# EAGLE design mk-logic (EAGLE 4.16)
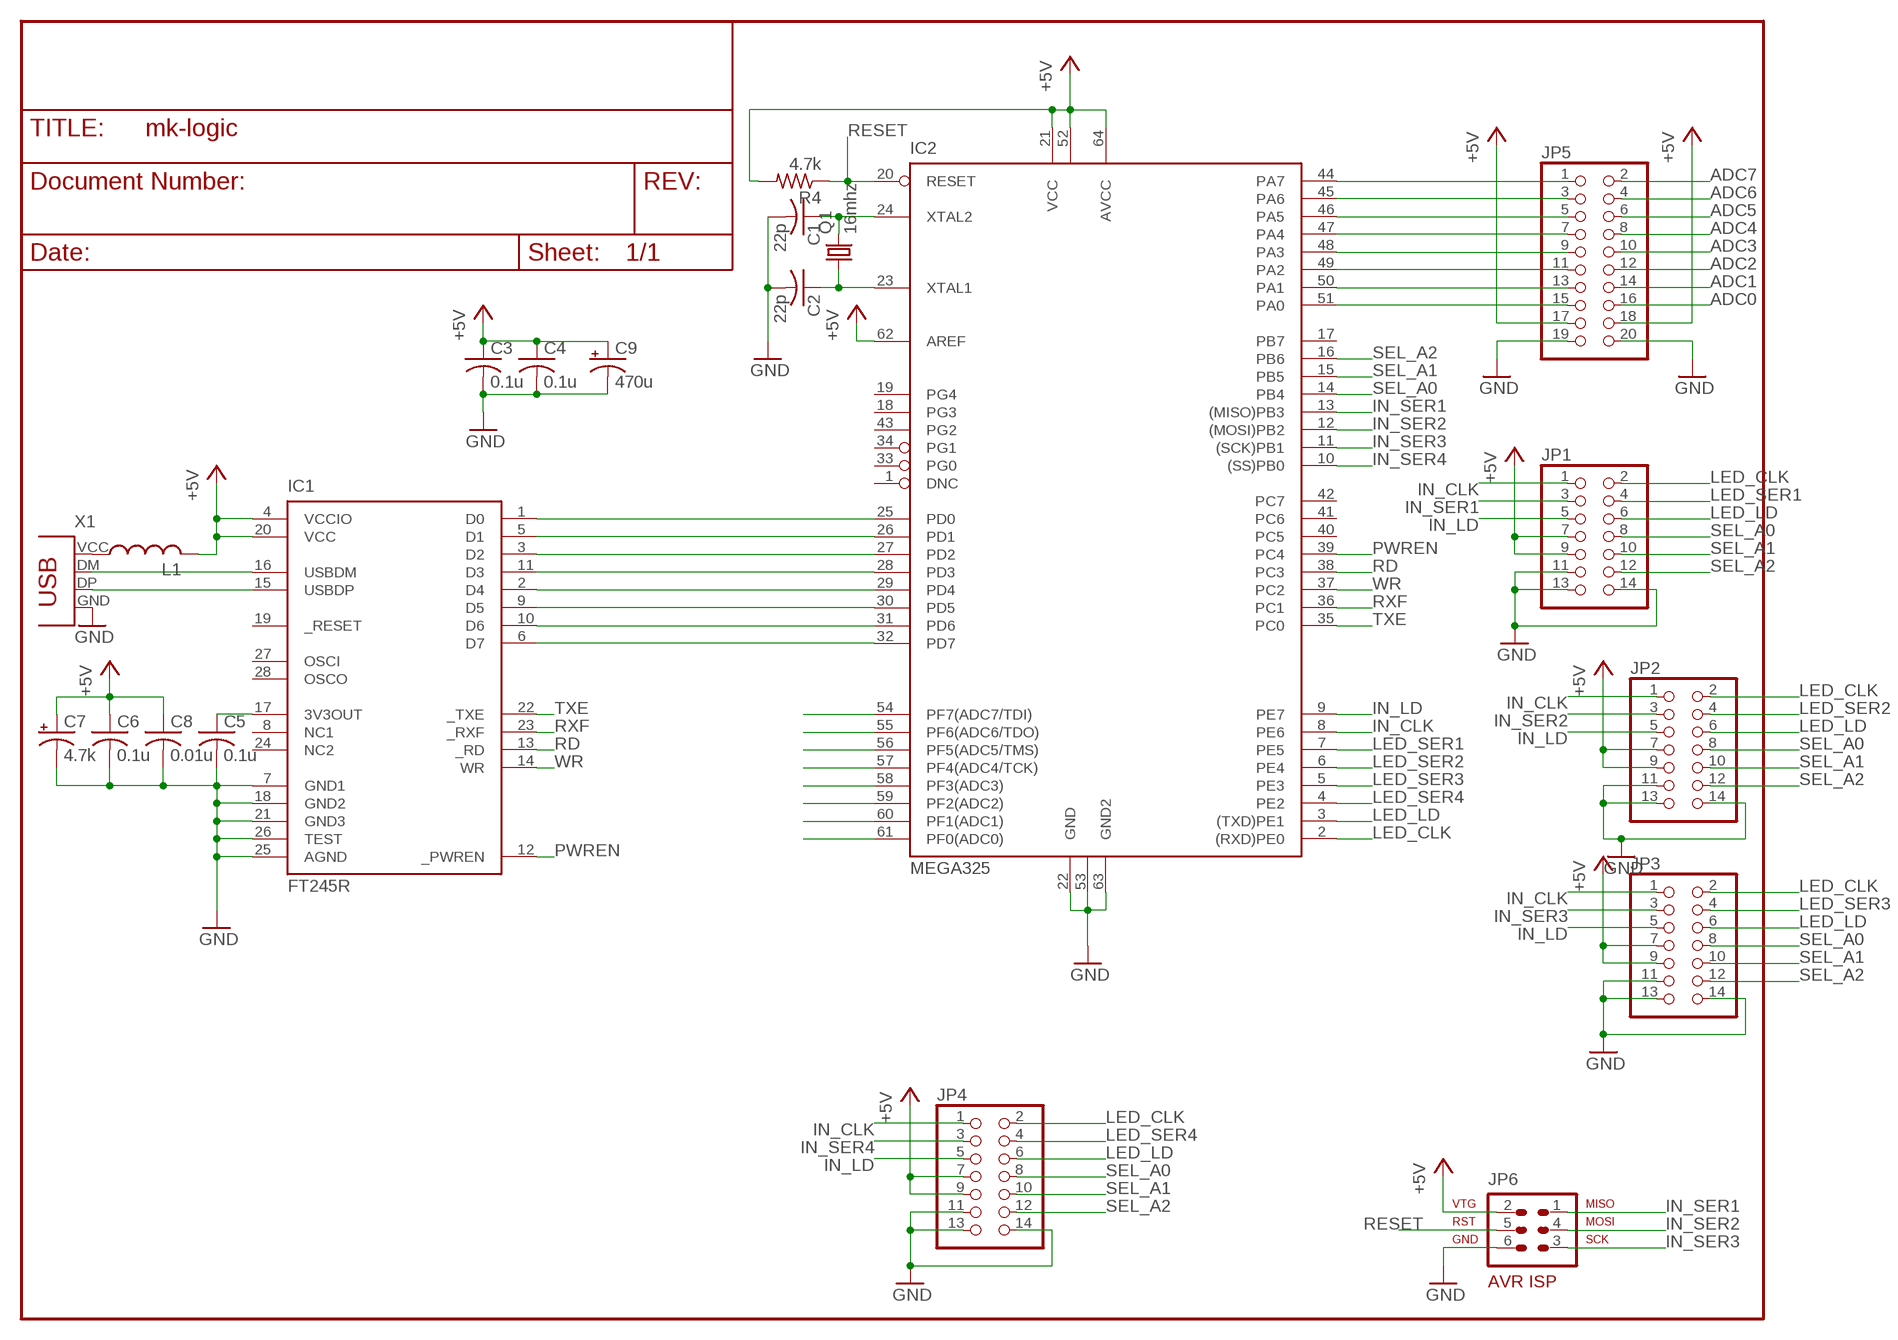
[diagram p0: schematic, sheet 1]

## Parts
C1  22p  C-USC1206  [C1206]
C2  22p  C-USC1206  [C1206]
C3  0.1u  C-USC1206  [C1206]
C4  0.1u  C-USC1206  [C1206]
C5  0.1u  C-USC1206  [C1206]
C6  0.1u  C-USC1206  [C1206]
C7  4.7k  CPOL-USB  [PANASONIC_B]
C8  0.01u  C-USC1206  [C1206]
C9  470u  CPOL-USE  [PANASONIC_E]
IC1  FT245R  [SSOP28]
IC2  MEGA325  [TQFP64]
JP1  PINHD-2X7  [2X07]
JP2  PINHD-2X7  [2X07]
JP3  PINHD-2X7  [2X07]
JP4  PINHD-2X7  [2X07]
JP5  PINHD-2X10  [2X10]
JP6  AVR-ISP  AVR-ISP-6  [AVR-ISP-6]
L1  L-USL3216C  [L3216C]
Q1  16mhz  CRYTALHC49UP  [HC49UP]
R4  4.7k  R-US_R1206  [R1206]
X1  USB_TYPE_B  [USB_B]

## Nets
+5V: C3.1 C4.1 C6.1 C7.+ C8.1 C9.+ IC1.4(VCCIO) IC1.20(VCC) IC2.21(VCC) IC2.52(VCC1) IC2.62(AREF) IC2.64(AVCC) JP1.7 JP1.9 JP2.7 JP2.9 JP3.7 JP3.9 JP4.7 JP4.9 JP5.17 JP5.18 JP6.2 L1.2 R4.2
ADC0: IC2.61(PF0(ADC0)) JP5.16
ADC1: IC2.60(PF1(ADC1)) JP5.14
ADC2: IC2.59(PF2(ADC2)) JP5.12
ADC3: IC2.58(PF3(ADC3)) JP5.10
ADC4: IC2.57(PF4(ADC4/TCK)) JP5.8
ADC5: IC2.56(PF5(ADC5/TMS)) JP5.6
ADC6: IC2.55(PF6(ADC6/TDO)) JP5.4
ADC7: IC2.54(PF7(ADC7/TDI)) JP5.2
GND: C1.2 C2.2 C3.2 C4.2 C5.2 C6.2 C7.- C8.2 C9.- IC1.7(GND1) IC1.18(GND2) IC1.21(GND3) IC1.25(AGND) IC1.26(TEST) IC2.22(GND) IC2.53(GND1) IC2.63(GND2) JP1.11 JP1.13 JP1.14 JP2.11 JP2.13 JP2.14 JP3.11 JP3.13 JP3.14 JP4.11 JP4.13 JP4.14 JP5.19 JP5.20 JP6.6 X1.GND
IN_CLK: IC2.8(PE6) JP1.1 JP2.1 JP3.1 JP4.1
IN_LD: IC2.9(PE7) JP1.5 JP2.5 JP3.5 JP4.5
IN_SER1: IC2.13((MISO)PB3) JP1.3 JP6.1
IN_SER2: IC2.12((MOSI)PB2) JP2.3 JP6.4
IN_SER3: IC2.11((SCK)PB1) JP3.3 JP6.3
IN_SER4: IC2.10((SS)PB0) JP4.3
LED_CLK: IC2.2((RXD)PE0) JP1.2 JP2.2 JP3.2 JP4.2
LED_LD: IC2.3((TXD)PE1) JP1.6 JP2.6 JP3.6 JP4.6
LED_SER1: IC2.7(PE5) JP1.4
LED_SER2: IC2.6(PE4) JP2.4
LED_SER3: IC2.5(PE3) JP3.4
LED_SER4: IC2.4(PE2) JP4.4
N$1: IC1.16(USBDM) X1.DM(USBDM)
N$2: IC1.15(USBDP) X1.DP(USBDP)
N$3: C5.1 IC1.17(3V3OUT)
N$4: IC2.44(PA7) JP5.1
N$5: IC2.45(PA6) JP5.3
N$6: IC2.46(PA5) JP5.5
N$7: IC2.47(PA4) JP5.7
N$8: C2.1 IC2.23(XTAL1) Q1.1
N$9: C1.1 IC2.24(XTAL2) Q1.2
N$10: IC2.48(PA3) JP5.9
N$11: IC2.49(PA2) JP5.11
N$12: L1.1 X1.VCC
N$13: IC1.1(D0) IC2.25(PD0)
N$14: IC1.5(D1) IC2.26(PD1)
N$15: IC1.3(D2) IC2.27(PD2)
N$16: IC1.11(D3) IC2.28(PD3)
N$17: IC1.2(D4) IC2.29(PD4)
N$18: IC1.9(D5) IC2.30(PD5)
N$19: IC1.10(D6) IC2.31(PD6)
N$20: IC1.6(D7) IC2.32(PD7)
N$23: IC2.50(PA1) JP5.13
N$24: IC2.51(PA0) JP5.15
PWREN: IC1.12(_PWREN) IC2.39(PC4)
RD: IC1.13(_RD) IC2.38(PC3)
RESET: IC2.20(RESET) JP6.5 R4.1
RXF: IC1.23(_RXF) IC2.36(PC1)
SEL_A0: IC2.14(PB4) JP1.8 JP2.8 JP3.8 JP4.8
SEL_A1: IC2.15(PB5) JP1.10 JP2.10 JP3.10 JP4.10
SEL_A2: IC2.16(PB6) JP1.12 JP2.12 JP3.12 JP4.12
TXE: IC1.22(_TXE) IC2.35(PC0)
WR: IC1.14(WR) IC2.37(PC2)
Unconnected: IC1.8(NC1) IC1.19(_RESET) IC1.24(NC2) IC1.27(OSCI) IC1.28(OSCO) IC2.1(DNC) IC2.17(PB7) IC2.18(PG3) IC2.19(PG4) IC2.33(PG0) IC2.34(PG1) IC2.40(PC5) IC2.41(PC6) IC2.42(PC7) IC2.43(PG2)

## Library data of the parts
C1-C6 C8 = rcl:C-US: CAPACITOR, American symbol
C7 C9 = rcl:CPOL-US: POLARIZED CAPACITOR, American symbol
IC1 = monome:FT245R: USB FIFO 2nd Generation USB FIFO (USB <-> Parallel)
IC2 = monome:MEGA325
JP1-JP4 = pinhead:PINHD-2X7: PIN HEADER
JP5 = pinhead:PINHD-2X10: PIN HEADER
JP6 = monome:AVR-ISP-6: AVR ISP-6 Serial Programming Header
L1 = rcl:L-US: INDUCTOR, American symbol
Q1 = crystal:CRYTAL: CRYSTAL
R4 = rcl:R-US_: RESISTOR, American symbol
X1 = monome:USB_TYPE_B: BERG USB connector

## Board
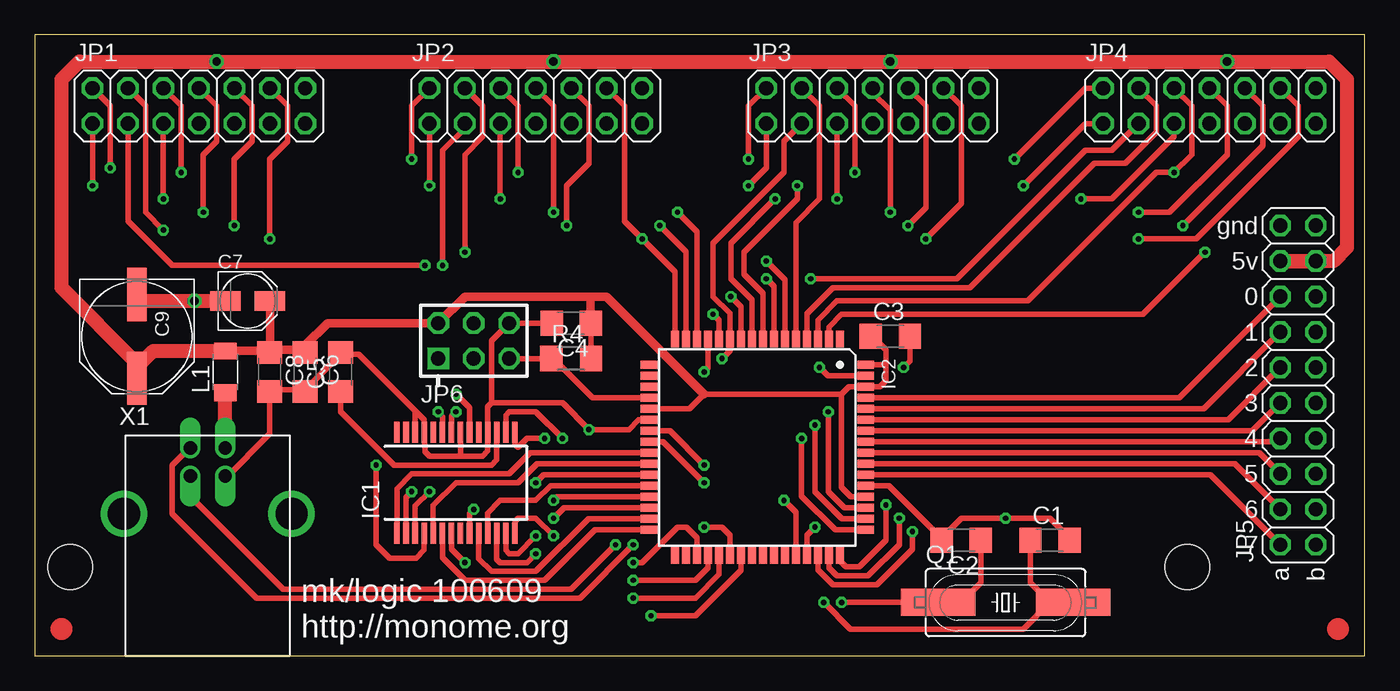
[diagram p1: board, top side]
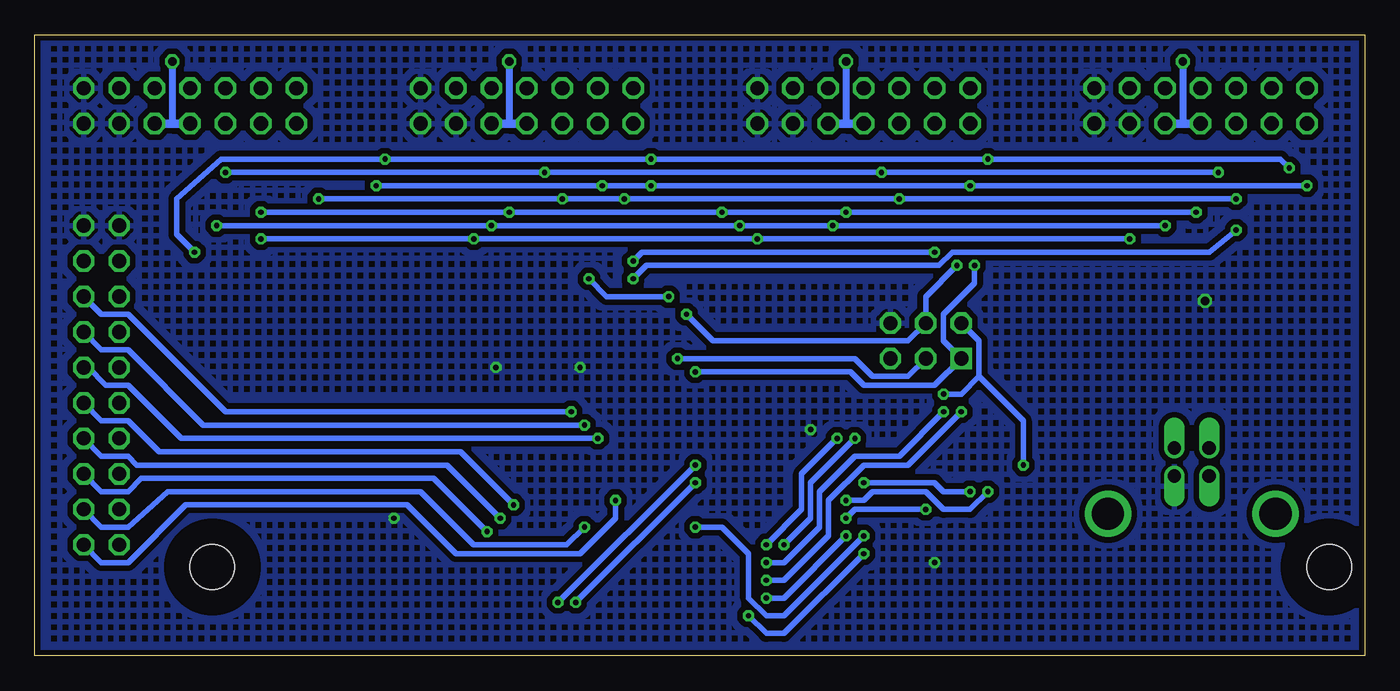
[diagram p2: board, bottom side, seen from below]

Size 95.25 x 44.45 mm. Coordinates in mm from the lower left corner, seen from the top.
Outline: 0,0 95.25,0 95.25,44.45 0,44.45 0,0
Copper layers (1+16): Top 0.035mm / dielectric 1.5mm / Bottom 0.035mm
Design rules "default": minimum track width 10mil, minimum drill 12mil, track to track 8mil, track to pad 8mil, pad to pad 8mil, via to via 8mil, smd to smd 8mil, copper to edge 10mil, drill to drill 8mil, minimum pad ring 10mil, minimum via ring 8mil, stop-mask expansion 4mil, vias tented up to drill 0mil, thermal gap 10mil
Holes 3.2 mm at 2.54,6.35 82.55,6.35
bRestrict: area 80,3.8 to 85.1,8.9; area 0,3.8 to 5.1,8.9

### Footprints (pad centres in the part's own frame; a part is rotated, then mirrored left to right if it is on the bottom)
C1206 = smd 1.6 x 1.8: 1 -1.4,0; 2 1.4,0
PANASONIC_B = smd 2.2 x 1.4: + 1.6,0; - -1.6,0
PANASONIC_E = smd 3.8 x 1.4: + 3,0; - -3,0
SSOP28 = smd 0.4 x 1.5: 1 -4.225,-3.625; 2 -3.575,-3.625; 3 -2.925,-3.625; 4 -2.275,-3.625; 5 -1.625,-3.625; 6 -0.975,-3.625; 7 -0.325,-3.625; 8 0.325,-3.625; 9 0.975,-3.625; 10 1.625,-3.625; 11 2.275,-3.625; 12 2.925,-3.625; 13 3.575,-3.625; 14 4.225,-3.625; 15 4.225,3.625; 16 3.575,3.625; 17 2.925,3.625; 18 2.275,3.625; 19 1.625,3.625; 20 0.975,3.625; 21 0.325,3.625; 22 -0.325,3.625; 23 -0.975,3.625; 24 -1.625,3.625; 25 -2.275,3.625; 26 -2.925,3.625; 27 -3.575,3.625; 28 -4.225,3.625
TQFP64 = smd 1.194 x 0.559: 1 -7.76,5.905; 2 -7.76,5.118; 3 -7.76,4.331; 4 -7.76,3.543; 5 -7.76,2.756; 6 -7.76,1.968; 7 -7.76,1.181; 8 -7.76,0.394; 9 -7.76,-0.394; 10 -7.76,-1.181; 11 -7.76,-1.968; 12 -7.76,-2.756; 13 -7.76,-3.543; 14 -7.76,-4.331; 15 -7.76,-5.118; 16 -7.76,-5.905; 33 7.76,-5.905; 34 7.76,-5.118; 35 7.76,-4.331; 36 7.76,-3.543; 37 7.76,-2.756; 38 7.76,-1.968; 39 7.76,-1.181; 40 7.76,-0.394; 41 7.76,0.394; 42 7.76,1.181; 43 7.76,1.968; 44 7.76,2.756; 45 7.76,3.543; 46 7.76,4.331; 47 7.76,5.118; 48 7.76,5.905 | smd 0.559 x 1.194: 17 -5.905,-7.76; 18 -5.118,-7.76; 19 -4.331,-7.76; 20 -3.543,-7.76; 21 -2.756,-7.76; 22 -1.968,-7.76; 23 -1.181,-7.76; 24 -0.394,-7.76; 25 0.394,-7.76; 26 1.181,-7.76; 27 1.968,-7.76; 28 2.756,-7.76; 29 3.543,-7.76; 30 4.331,-7.76; 31 5.118,-7.76; 32 5.905,-7.76; 49 5.905,7.76; 50 5.118,7.76; 51 4.331,7.76; 52 3.543,7.76; 53 2.756,7.76; 54 1.968,7.76; 55 1.181,7.76; 56 0.394,7.76; 57 -0.394,7.76; 58 -1.181,7.76; 59 -1.968,7.76; 60 -2.756,7.76; 61 -3.543,7.76; 62 -4.331,7.76; 63 -5.118,7.76; 64 -5.905,7.76
2X07 = drill 1.016 octagon: 1 -7.62,-1.27; 2 -7.62,1.27; 3 -5.08,-1.27; 4 -5.08,1.27; 5 -2.54,-1.27; 6 -2.54,1.27; 7 0,-1.27; 8 0,1.27; 9 2.54,-1.27; 10 2.54,1.27; 11 5.08,-1.27; 12 5.08,1.27; 13 7.62,-1.27; 14 7.62,1.27
2X10 = drill 1.016 octagon: 1 -11.43,-1.27; 2 -11.43,1.27; 3 -8.89,-1.27; 4 -8.89,1.27; 5 -6.35,-1.27; 6 -6.35,1.27; 7 -3.81,-1.27; 8 -3.81,1.27; 9 -1.27,-1.27; 10 -1.27,1.27; 11 1.27,-1.27; 12 1.27,1.27; 13 3.81,-1.27; 14 3.81,1.27; 15 6.35,-1.27; 16 6.35,1.27; 17 8.89,-1.27; 18 8.89,1.27; 19 11.43,-1.27; 20 11.43,1.27
AVR-ISP-6 = drill 1.016 square: 1 -2.54,-1.27 | drill 1.016 octagon: 2 -2.54,1.27; 3 0,-1.27; 4 0,1.27; 5 2.54,-1.27; 6 2.54,1.27
L3216C = smd 1.2 x 1.6: 1 -1.5,0; 2 1.5,0
HC49UP = smd 5.334 x 1.93: 1 -4.826,0; 2 4.826,0
R1206 = smd 1.6 x 1.803: 1 -1.422,0; 2 1.422,0
USB_B = drill 0.95 offset: DM -1.25,4.71; DP -1.25,2.71; GND 1.25,2.71; VCC 1.25,4.71 | drill 2.3 round: MOUNT1 -6,0; MOUNT2 6,0

### Placement (x,y rotation side)
C1  72.71,8.26 0 top
C2  66.36,8.26 180 top
C3  61.28,22.86 0 top
C4  38.42,23.81 180 top
C5  21.91,20.32 90 top
C6  19.37,20.32 270 top
C7  15.24,25.4 0 top
C8  16.83,20.32 270 top
C9  7.3,22.86 270 top
IC1  30.16,12.38 0 top
IC2  51.75,14.92 270 top
JP1  11.75,39.37 0 top
JP2  35.88,39.37 0 top
JP3  60.01,39.37 0 top
JP4  84.14,39.37 0 top
JP5  90.49,19.37 90 top
JP6  31.43,22.54 0 top
L1  13.65,20.32 90 top
Q1  69.53,3.81 0 top
R4  38.42,21.27 0 top
U$1  [FEDUCIAL]  93.34,1.91 0 top
U$2  [FEDUCIAL]  1.91,1.91 0 top
X1  12.38,10.16 0 top

### Tracks (layer width: path | path; a pad name or v marks a point on that pad's centre or on a via)
+5V  (via drill 0.38, 0.6)
  Top 0.406: IC2.64 60.96,20.83 60.96,20.64 | 60.96,20.64 60.96,19.68 60.53,19.25 IC2.62 58.31,19.25 57.78,18.73 | IC1.20 31.14,17.76 v30.16,18.73 | IC1.4 27.89,7.57 27.3,6.99 25.4,6.99 24.45,7.94 v24.45,13.65 | IC2.21 46.89,17.68 47.94,18.73 57.78,18.73 | IC2.52 58.47,11.38 57.78,12.06 57.78,18.73 | 40.01,25.72 39.82,25.72 | C4.1 39.69,23.81 39.84,23.66 R4.2 | C3.1 60.2,22.67 60.96,21.91 60.96,20.64
  Top 0.508: 7.3,20.64 7.3,20.95
  Top 0.61: 47.94,18.73 40.96,25.72 40.01,25.72 30.8,25.72 JP6.2 20.95,23.81 19.37,22.23 C6.1 19.37,21.59 19.05,21.91 16.83,21.91 | 39.82,25.72 C4.1 | L1.2 16.74,21.82 16.83,21.91 | 16.83,21.91 C8.1 | C7.+ 16.84,21.92 16.83,21.91
  Top 1.016: L1.2 8.48,21.82 7.3,20.64 C9.+ 7.3,19.68 | 7.3,20.95 1.91,26.35 1.91,41.27 3.17,42.55 v13.02,42.55 v37.15,42.55 v61.28,42.55 v85.41,42.55 92.71,42.55 93.98,41.27 93.98,29.21 93.03,28.26 JP5.18 JP5.17
  Bottom 0.406: 27.62,20 27.62,22.54 JP6.2 | 27.62,20 28.89,18.73 v30.16,18.73 | v24.45,13.65 24.45,16.83 27.62,20
  Bottom 0.508: v85.41,42.55 85.41,38.1 | v61.28,42.55 61.28,38.1 | v37.15,42.55 37.15,38.1 | v13.02,42.55 13.02,38.1
  Bottom 0.61: JP1.9 13.02,38.1 JP1.7 | JP2.9 37.15,38.1 JP2.7 | JP3.7 61.28,38.1 JP3.9 | JP4.7 85.41,38.1 JP4.9
ADC0
  Top 0.406: IC2.61 81.97,18.47 JP5.16
ADC1
  Top 0.406: IC2.60 83.72,17.68 JP5.14
ADC2
  Top 0.406: IC2.59 85.47,16.89 JP5.12
ADC3
  Top 0.406: IC2.58 87.22,16.1 JP5.10
ADC4
  Top 0.406: IC2.57 88.98,15.32 JP5.8
ADC5
  Top 0.406: IC2.56 87.71,14.53 JP5.6
ADC6
  Top 0.406: IC2.55 85.95,13.74 JP5.4
ADC7
  Top 0.406: IC2.54 84.2,12.95 JP5.2
GND  (via drill 0.38, 0.6)
  Top 0.406: 27.3,17.46 27.89,16.88 IC1.25 27.94,14.61 28.26,14.29 30.16,14.29 | 30.16,14.29 32.07,14.29 32.44,14.66 IC1.18 32.44,17.83 32.7,18.1 | IC1.21 30.49,14.29 30.16,14.29 | IC1.7 29.84,7.63 v30.8,6.67 | IC2.63 56.79,20.04 v56.2,20.64 | 37.15,23.81 C4.2 JP6.6 32.7,22.54 32.7,18.1 | 32.7,18.1 37.78,18.1 v39.69,16.19 42.55,16.19 43.24,16.89 IC2.22 | IC1.26 27.24,17.46 27.3,17.46 | 27.3,17.46 23.18,21.59 21.91,21.59 | 21.91,21.59 C5.2 | 19.37,19.05 21.91,21.59 | 19.37,19.05 C6.2 | 19.37,19.05 19.24,18.92 | X1.GND 13.63,12.72 13.65,12.7 16.83,15.88 C8.2 | 16.83,19.05 19.37,19.05 | C1.2 74.3,8.26 72.71,9.84 v69.53,9.84 66.36,9.84 64.96,8.44 C2.2 65.09,8.26 61.18,12.17 IC2.53 | C3.2 62.68,21.09 v62.23,20.64
  Top 1.016: C9.- 7.3,25.72 7.62,25.4 v11.43,25.4 C7.-
  pour Bottom (isolate 0.406, hatched): 0,0 0,44.45 95.25,44.45 95.25,0
IN_CLK  (via drill 0.38)
  Top 0.406: v4.13,33.66 JP1.1 | v28.26,33.66 JP2.1 | IC2.8 52.15,25.96 50.8,27.3 50.8,28.89 54.61,32.7 v54.61,33.66 | v51.12,33.66 52.39,34.92 JP3.1 | JP4.1 75.25,38.1 v70.8,33.66
  Bottom 0.406: v70.8,33.66 v54.61,33.66 v51.12,33.66 v28.26,33.66 v4.13,33.66
IN_LD  (via drill 0.38)
  Top 0.406: v53.02,32.7 49.85,29.53 49.85,26.99 51.36,25.48 IC2.9 | v9.21,32.7 JP1.5 | v33.34,32.7 JP2.5 | v57.47,32.7 JP3.5 | JP4.5 81.6,37.15 77.15,32.7 v74.93,32.7
  Bottom 0.406: v9.21,32.7 v33.34,32.7 v53.02,32.7 v57.47,32.7 v74.93,32.7
IN_SER1  (via drill 0.38)
  Top 0.406: IC2.13 48.21,20.59 v47.94,20.32 | v27.94,27.94 9.84,27.94 6.67,31.11 JP1.3
  Bottom 0.406: v47.94,20.32 36.83,20.32 35.88,19.37 30.8,19.37 JP6.1 30.16,22.54 30.16,24.45 27.94,26.67 v27.94,27.94
IN_SER2  (via drill 0.38)
  Top 0.406: IC2.12 49,24.03 v48.58,24.45 | JP2.3 30.8,37.78 29.21,36.2 v29.21,27.94
  Bottom 0.406: v48.58,24.45 46.67,22.54 32.7,22.54 JP6.4 31.43,25.72 v29.21,27.94
IN_SER3  (via drill 0.38)
  Top 0.406: v49.21,21.27 49.78,21.84 IC2.11 49.78,24.51 48.58,25.72 48.58,29.53 53.66,34.61 53.66,36.83 JP3.3
  Bottom 0.406: JP6.3 32.7,20 35.24,20 36.51,21.27 v49.21,21.27
IN_SER4  (via drill 0.38)
  Top 0.406: IC2.10 50.57,24.99 v49.85,25.72 | v55.56,26.99 66.04,26.99 75.25,36.2 77.15,36.2 JP4.3
  Bottom 0.406: v49.85,25.72 54.29,25.72 v55.56,26.99
LED_CLK  (via drill 0.38)
  Top 0.406: IC2.2 56.87,23.53 57.78,24.45 79.38,24.45 v83.82,28.89 | v5.4,34.92 5.4,39.37 JP1.2 | JP2.2 26.99,39.37 v26.99,35.56 | JP3.2 51.12,39.37 v51.12,35.56 | v70.17,35.56 75.25,40.64 JP4.2
  Bottom 0.406: v83.82,28.89 85.09,30.16 85.09,32.7 81.92,35.56 v70.17,35.56 v51.12,35.56 v26.99,35.56 6.03,35.56 v5.4,34.92
LED_LD  (via drill 0.38)
  Top 0.406: IC2.3 56.08,24.02 57.47,25.4 71.12,25.4 80.33,34.61 v81.6,34.61 82.87,35.88 82.87,39.37 JP4.6 | v10.48,34.61 10.48,39.37 JP1.6 | JP2.6 34.61,39.37 v34.61,34.61 | JP3.6 58.74,39.37 v58.74,34.61
  Bottom 0.406: v10.48,34.61 v34.61,34.61 v58.74,34.61 v81.6,34.61
LED_SER1  (via drill 0.38)
  Top 0.406: IC2.7 52.93,26.44 v52.39,26.99 | JP1.4 7.94,39.37 7.94,31.75 v9.21,30.48
  Bottom 0.406: v52.39,26.99 51.44,27.94 30.48,27.94 29.53,28.89 11.11,28.89 v9.21,30.48
LED_SER2  (via drill 0.38)
  Top 0.406: IC2.6 53.72,26.92 v52.39,28.26 | v30.8,28.89 30.8,35.88 32.07,37.15 32.07,39.37 JP2.4
  Bottom 0.406: v30.8,28.89 51.75,28.89 v52.39,28.26
LED_SER3
  Top 0.406: JP3.4 56.2,39.37 56.2,32.7 54.51,31.01 IC2.5
LED_SER4
  Top 0.406: IC2.4 55.3,24.5 57.15,26.35 66.99,26.35 75.88,35.24 78.11,35.24 80.33,37.47 80.33,39.37 JP4.4
N$1  (via drill 0.38)
  Top 0.406: IC1.16 33.74,17.23 33.97,17.46 35.88,17.46 v37.78,15.56 | v42.86,7.94 39.05,4.13 15.88,4.13 9.84,10.16 9.84,13.65 11.11,14.92 11.13,14.9 X1.DM
  Bottom 0.406: v37.78,15.56 40.32,13.02 40.32,10.48 v42.86,7.94
N$2  (via drill 0.38)
  Top 0.406: v41.59,7.94 38.42,4.76 17.78,4.76 11.13,11.41 X1.DP | IC1.15 34.39,15.14 34.61,14.92 35.24,15.56 v36.51,15.56
  Bottom 0.406: v36.51,15.56 39.69,12.38 39.69,9.84 v41.59,7.94
N$3
  Top 0.406: IC1.17 33.09,14.04 32.7,13.65 25.72,13.65 21.91,17.46 C5.1
N$4  (via drill 0.38)
  Top 0.406: IC2.44 54.51,10.26 v53.66,11.11
  Bottom 0.406: v53.66,11.11 53.66,9.84 56.2,7.3 65.09,7.3 68.58,10.79 84.45,10.79 88.58,6.67 90.49,6.67 JP5.1
N$5  (via drill 0.38)
  Top 0.406: IC2.45 55.3,8.62 v55.88,9.21
  Bottom 0.406: v55.88,9.21 57.15,7.94 63.82,7.94 67.63,11.75 85.72,11.75 88.58,9.21 90.49,9.21 JP5.3
N$6  (via drill 0.38)
  Top 0.406: IC2.46 56.08,6.15 57.15,5.08 60.33,5.08 62.87,7.62 v62.87,8.89
  Bottom 0.406: v62.87,8.89 66.67,12.7 87.63,12.7 88.58,11.75 90.49,11.75 JP5.5
N$7  (via drill 0.38)
  Top 0.406: IC2.47 56.87,6.31 57.47,5.71 59.69,5.71 61.91,7.94 v61.91,9.84
  Bottom 0.406: v61.91,9.84 65.72,13.65 87.95,13.65 88.58,14.29 90.49,14.29 JP5.7
N$8  (via drill 0.38)
  Top 0.406: IC2.23 45.49,16.1 v47.94,13.65 | v57.78,3.81 Q1.1 66.36,3.81 67.76,5.21 C2.1
  Bottom 0.406: v47.94,13.65 v57.78,3.81
N$9  (via drill 0.38)
  Top 0.406: IC2.24 45.01,15.32 v47.94,12.38 | v56.52,3.81 58.42,1.91 70.8,1.91 72.71,3.81 | 72.71,3.81 Q1.2 | C1.1 71.31,5.21 72.71,3.81
  Bottom 0.406: v47.94,12.38 v56.52,3.81
N$10  (via drill 0.38)
  Top 0.406: IC2.48 57.66,6.79 58.1,6.35 59.05,6.35 60.96,8.26 v60.96,10.79
  Bottom 0.406: v60.96,10.79 64.77,14.61 86.36,14.61 88.58,16.83 90.49,16.83 JP5.9
N$11  (via drill 0.38)
  Top 0.406: IC2.49 57.34,9.02 54.93,11.43 v54.93,15.56
  Bottom 0.406: JP5.11 91.44,20.64 90.17,19.37 88.58,19.37 84.77,15.56 v54.93,15.56
N$12
  Top 1.016: L1.1 13.65,18.73 13.63,18.71 X1.VCC
N$13
  Top 0.406: IC1.1 25.94,11.97 26.99,13.02 33.97,13.02 35.48,14.53 IC2.25
N$14
  Top 0.406: IC2.26 35.97,13.74 34.61,12.38 30.16,12.38 28.54,10.76 IC1.5
N$15  (via drill 0.38)
  Top 0.406: IC2.27 36.45,12.95 v35.88,12.38 | IC1.3 27.24,10.73 v28.26,11.75
  Bottom 0.406: v28.26,11.75 30.16,11.75 30.8,12.38 v35.88,12.38
N$16
  Top 0.406: IC2.28 36.93,12.17 35.88,11.11 33.34,11.11 32.44,10.21 IC1.11
N$17  (via drill 0.38)
  Top 0.406: IC2.29 37.41,11.38 v37.15,11.11 | 26.59,8.81 IC1.2 26.59,11.35 v26.99,11.75
  Bottom 0.406: v26.99,11.75 28.26,10.48 30.16,10.48 31.43,11.75 35.24,11.75 35.88,11.11 v37.15,11.11
N$18  (via drill 0.38)
  Top 0.406: IC2.30 37.9,10.59 v37.15,9.84 | IC1.9 31.14,10.18 v31.43,10.48
  Bottom 0.406: v37.15,9.84 36.51,10.48 v31.43,10.48
N$19
  Top 0.406: IC2.31 39.65,9.8 35.88,6.03 32.7,6.03 31.79,6.95 IC1.10
N$20
  Top 0.406: IC2.32 40.13,9.02 36.51,5.4 30.8,5.4 29.19,7.01 IC1.6
N$23  (via drill 0.38)
  Top 0.406: IC2.50 57.82,9.8 55.88,11.75 v55.88,16.51
  Bottom 0.406: v55.88,16.51 83.19,16.51 88.58,21.91 90.49,21.91 JP5.13
N$24  (via drill 0.38)
  Top 0.406: IC2.51 57.99,10.59 56.83,11.75 v56.83,17.46
  Bottom 0.406: v56.83,17.46 81.6,17.46 88.58,24.45 90.49,24.45 JP5.15
PWREN  (via drill 0.38)
  Top 0.406: IC1.12 33.09,6.92 33.34,6.67 35.24,6.67 v35.88,7.3 | v44.13,2.86 47.31,2.86 50.57,6.12 IC2.39
  Bottom 0.406: v35.88,7.3 41.59,1.59 42.86,1.59 v44.13,2.86
RD  (via drill 0.38)
  Top 0.406: IC1.13 33.74,7.54 33.97,7.3 34.61,7.3 v35.88,8.57 | v47.94,9.21 49.21,9.21 49.78,8.64 IC2.38
  Bottom 0.406: v35.88,8.57 41.59,2.86 42.86,2.86 44.13,4.13 44.13,7.3 46.04,9.21 v47.94,9.21
RESET
  Top 0.406: IC2.20 39.95,18.47 37.15,21.27 | 37.15,21.27 R4.1 | JP6.5 37.15,21.27
RXF  (via drill 0.38)
  Top 0.406: IC1.23 29.19,17.12 v28.89,17.46 | v42.86,5.4 47.31,5.4 48.21,6.3 IC2.36
  Bottom 0.406: v28.89,17.46 32.7,13.65 35.88,13.65 38.42,11.11 38.42,8.57 41.59,5.4 v42.86,5.4
SEL_A0  (via drill 0.38)
  Top 0.406: v46.04,31.75 47.42,30.37 IC2.14 | v12.06,31.75 12.06,35.88 13.02,36.83 13.02,39.37 JP1.8 | JP2.8 37.15,39.37 v37.15,31.75 | JP3.8 60.01,40.32 61.28,39.05 v61.28,31.75 | JP4.8 85.41,39.37 85.41,35.88 81.28,31.75 v79.06,31.75
  Bottom 0.406: v12.06,31.75 v37.15,31.75 v46.04,31.75 v61.28,31.75 v79.06,31.75
SEL_A1  (via drill 0.38)
  Top 0.406: v44.77,30.8 46.63,28.93 IC2.15 | v14.29,30.8 14.29,35.56 15.56,36.83 15.56,39.37 JP1.10 | JP2.10 39.69,39.37 39.69,35.24 38.1,33.66 v38.1,30.8 | JP3.10 63.82,39.37 63.82,32.07 v62.55,30.8 | JP4.10 87.95,39.37 87.95,36.51 v82.23,30.8
  Bottom 0.406: v14.29,30.8 v38.1,30.8 v44.77,30.8 v62.55,30.8 v82.23,30.8
SEL_A2  (via drill 0.38)
  Top 0.406: IC2.16 45.85,27.5 v43.5,29.84 42.23,31.11 42.23,39.37 JP2.12 | v16.83,29.84 16.83,35.56 18.1,36.83 18.1,39.37 JP1.12 | JP3.12 66.36,39.37 66.36,32.38 v63.82,29.84 | JP4.12 90.49,39.37 90.49,37.15 83.19,29.84 v79.06,29.84
  Bottom 0.406: v16.83,29.84 v43.5,29.84 v63.82,29.84 v79.06,29.84
TXE  (via drill 0.38)
  Top 0.406: IC1.22 29.84,17.15 v30.16,17.46 | v42.86,6.67 43.5,6.67 46.04,9.21 46.67,9.21 47.42,8.46 IC2.35
  Bottom 0.406: v30.16,17.46 33.34,14.29 36.51,14.29 39.05,11.75 39.05,9.21 41.59,6.67 v42.86,6.67
WR  (via drill 0.38)
  Top 0.406: IC1.14 34.39,9.62 34.61,9.84 35.88,9.84 v37.15,8.57 | v42.86,4.13 47.31,4.13 49,5.82 IC2.37
  Bottom 0.406: v37.15,8.57 41.59,4.13 v42.86,4.13

### Text on the board
tPlace: gnd | 5v | 0 | 1 | 2 | 3 | 4 | 5 | 6 | 7 | a | b | mk/logic 100609 | http://monome.org